# EAGLE design power (EAGLE 9.1.3)
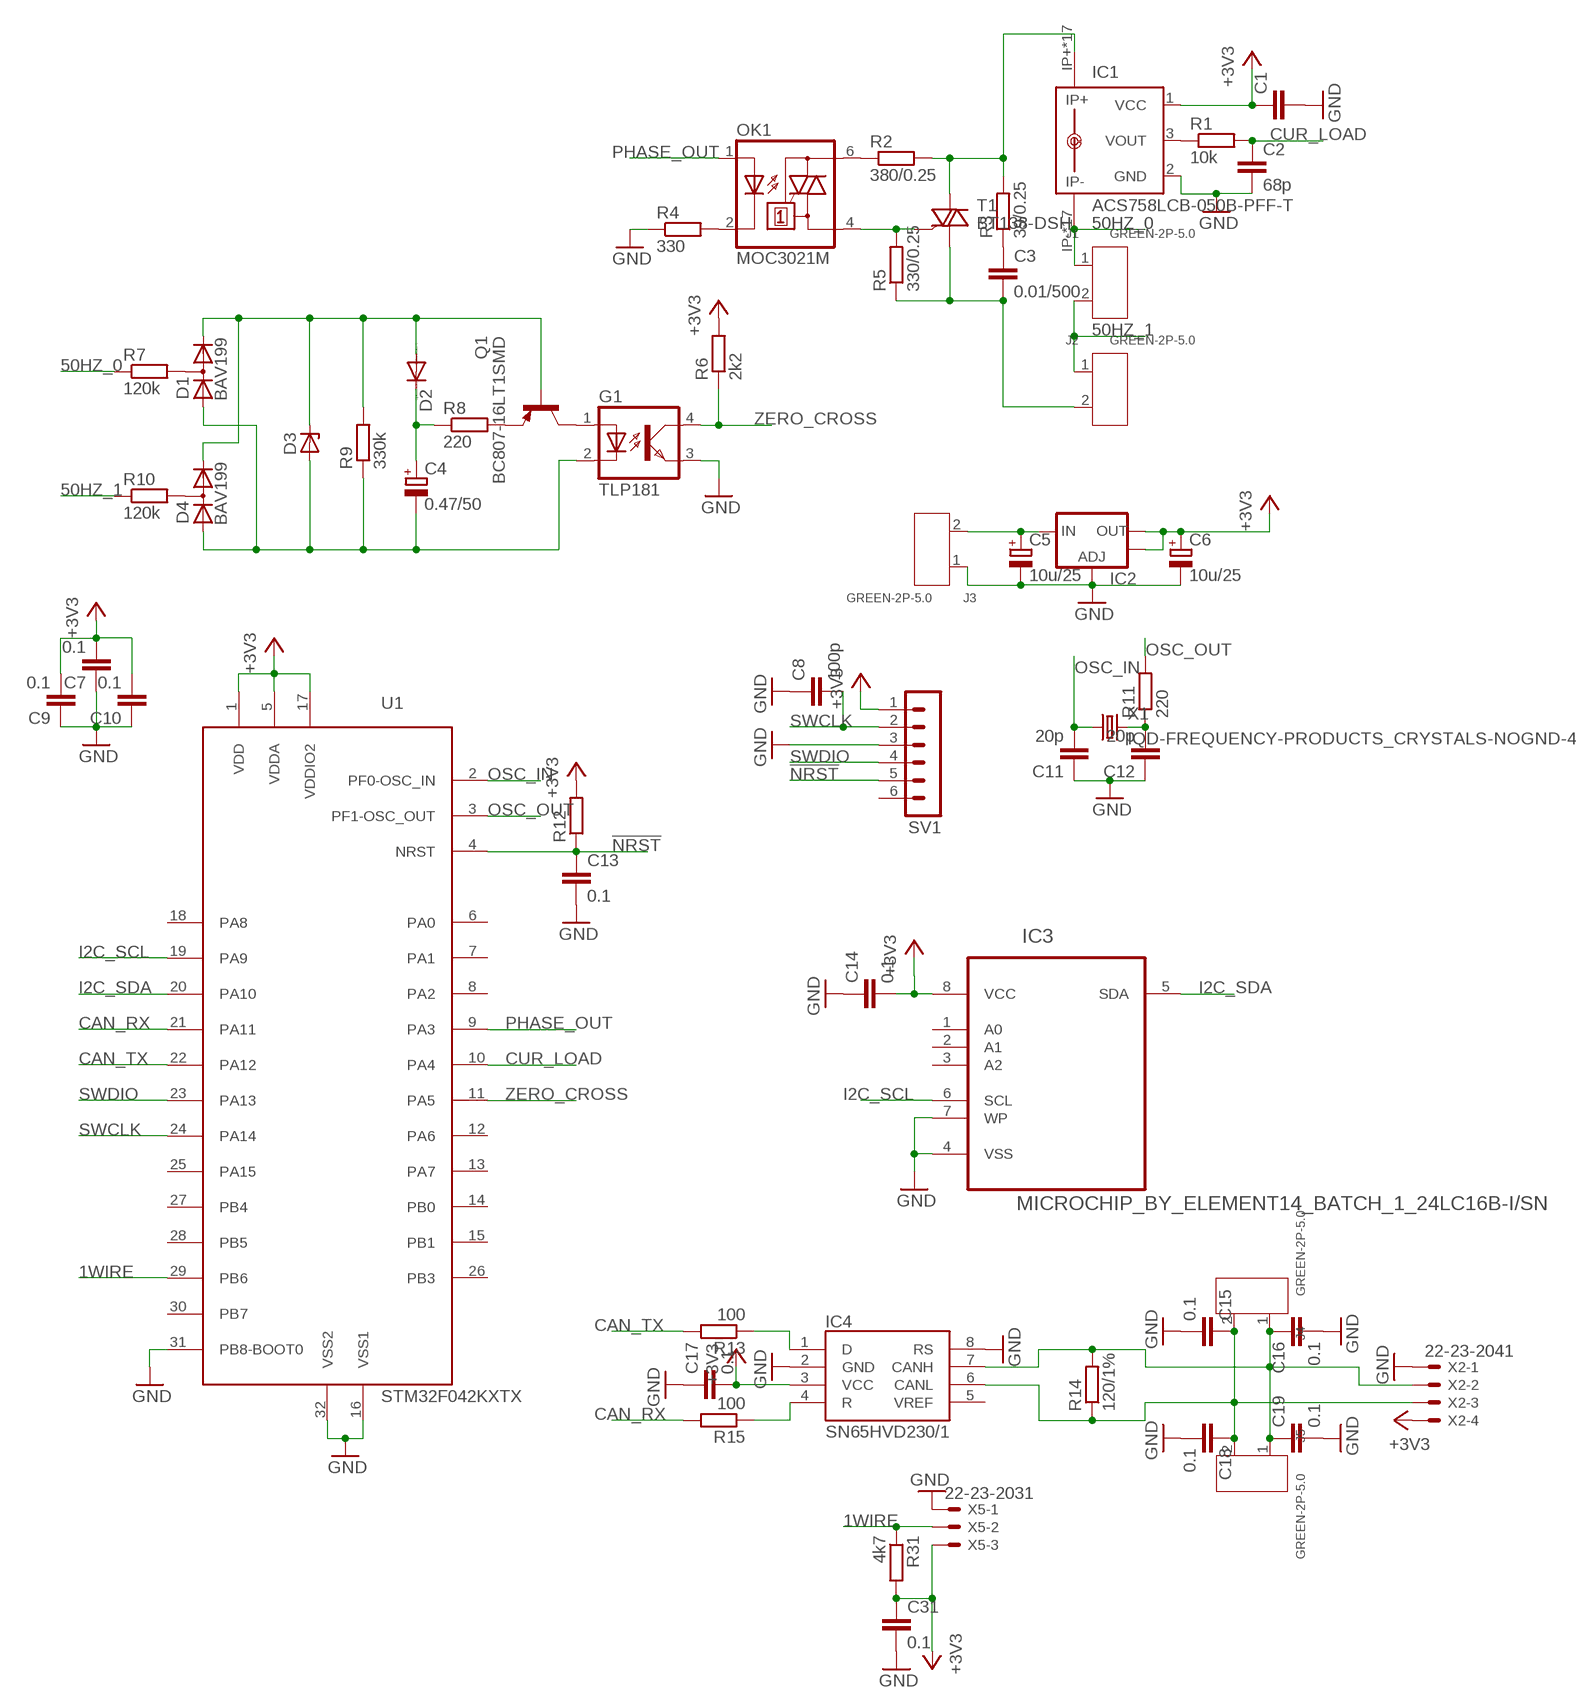
[diagram p0: schematic, sheet 1, part 1 of 2]
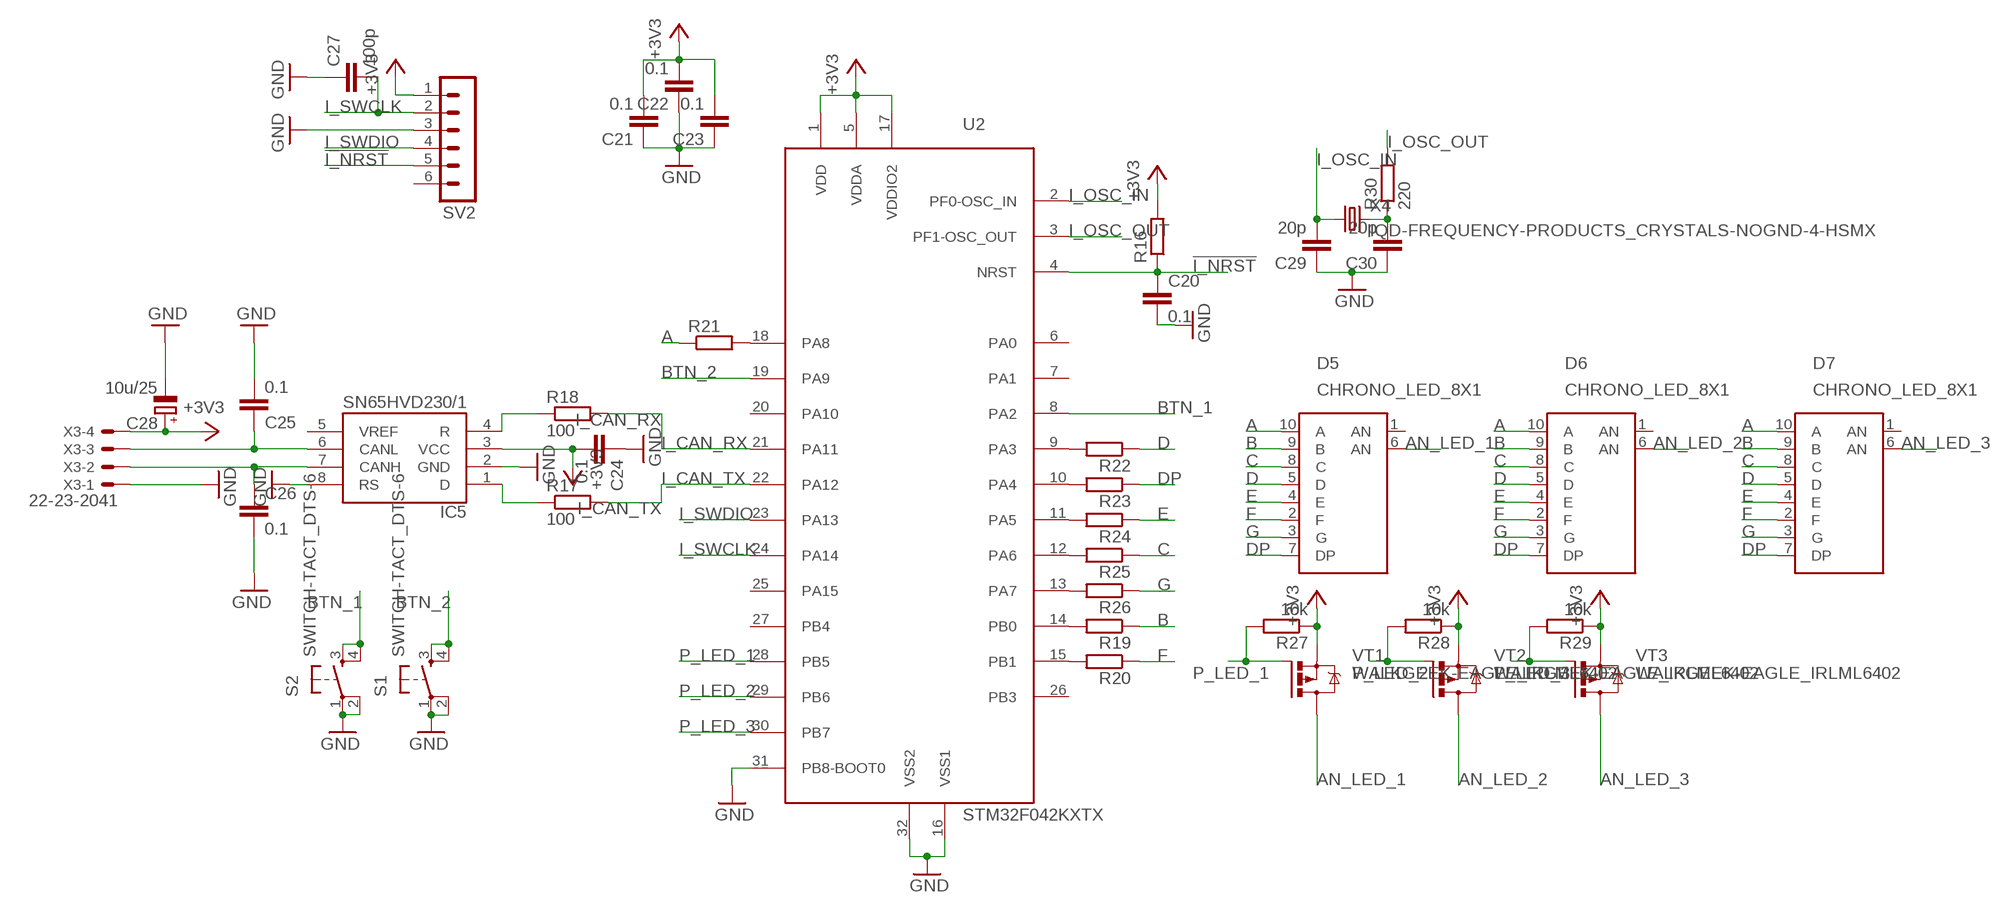
[diagram p1: schematic, sheet 1, part 2 of 2]

## Parts
C1  C-EUC0603  [C0603]
C2  68p  C-EUC0603  [C0603]
C3  0.01/500  C-EUC1206  [C1206]
C4  0.47/50  CPOL-EUC/6032-28R  [C/6032-28R]
C5  10u/25  CPOL-EUSMCB  [SMC_B]
C6  10u/25  CPOL-EUSMCB  [SMC_B]
C7  0.1  C-EUC0603  [C0603]
C8  100p  C-EUC0603  [C0603]
C9  0.1  C-EUC0603  [C0603]
C10  0.1  C-EUC0603  [C0603]
C11  20p  C-EUC0603  [C0603]
C12  20p  C-EUC0603  [C0603]
C13  0.1  C-EUC0603  [C0603]
C14  0.1  C-EUC0603  [C0603]
C15  0.1  C-EUC0603  [C0603]
C16  0.1  C-EUC0603  [C0603]
C17  0.1  C-EUC0603  [C0603]
C18  0.1  C-EUC0603  [C0603]
C19  0.1  C-EUC0603  [C0603]
C20  0.1  C-EUC0603  [C0603]
C21  0.1  C-EUC0603  [C0603]
C22  0.1  C-EUC0603  [C0603]
C23  0.1  C-EUC0603  [C0603]
C24  0.1  C-EUC0603  [C0603]
C25  0.1  C-EUC0603  [C0603]
C26  0.1  C-EUC0603  [C0603]
C27  100p  C-EUC0603  [C0603]
C28  10u/25  CPOL-EUSMCB  [SMC_B]
C29  20p  C-EUC0603  [C0603]
C30  20p  C-EUC0603  [C0603]
C31  0.1  C-EUC0603  [C0603]
D1  BAV199  [SOT23]
D2  DIODE-SOD523  [SOD523]
D3  ZENER-DIODESOD80C  [SOD80C]
D4  BAV199  [SOT23]
D5  CHRONO_LED_8X1  [CHRONO_LED_DIP10]
D6  CHRONO_LED_8X1  [CHRONO_LED_DIP10]
D7  CHRONO_LED_8X1  [CHRONO_LED_DIP10]
G1  TLP181  [SOP04]
IC1  ACS758LCB-050B-PFF-T  [CB-PFF]
IC2  V_REG_LM1117SOT223  [SOT223]
IC3  MICROCHIP_BY_ELEMENT14_BATCH_1_24LC16B-I/SN  [MICROCHIP_BY_ELEMENT14_BATCH_1_SOIC127P600X175-8N]
IC4  SN65HVD230/1  [SO8]
IC5  SN65HVD230/1  [SO8]
J1  GREEN-2P-5.0  SCREW-TERMINAL-GREEN(2P-5.0)  [H2-5.0-10.5X8.0MM]
J2  GREEN-2P-5.0  SCREW-TERMINAL-GREEN(2P-5.0)  [H2-5.0-10.5X8.0MM]
J3  GREEN-2P-5.0  SCREW-TERMINAL-GREEN(2P-5.0)  [H2-5.0-10.5X8.0MM]
J4  GREEN-2P-5.0  SCREW-TERMINAL-GREEN(2P-5.0)  [H2-5.0-10.5X8.0MM]
J5  GREEN-2P-5.0  SCREW-TERMINAL-GREEN(2P-5.0)  [H2-5.0-10.5X8.0MM]
OK1  MOC3021M  [DIL06]
Q1  BC807-16LT1SMD  [SOT23-BEC]
R1  10k  R-EU_R0603  [R0603]
R2  380/0.25  R-EU_M1206  [M1206]
R3  39/0.25  R-EU_M1206  [M1206]
R4  330  R-EU_R0603  [R0603]
R5  330/0.25  R-EU_M1206  [M1206]
R6  2k2  R-EU_R0603  [R0603]
R7  120k  R-EU_R1206  [R1206]
R8  220  R-EU_R1206  [R1206]
R9  330k  R-EU_R1206  [R1206]
R10  120k  R-EU_R1206  [R1206]
R11  220  R-EU_R0603  [R0603]
R12  R-EU_R0603  [R0603]
R13  100  R-EU_R0603  [R0603]
R14  120/1%  R-EU_R0603  [R0603]
R15  100  R-EU_R0603  [R0603]
R16  R-EU_R0603  [R0603]
R17  100  R-EU_R0603  [R0603]
R18  100  R-EU_R0603  [R0603]
R19  R-EU_R0603  [R0603]
R20  R-EU_R0603  [R0603]
R21  R-EU_R0603  [R0603]
R22  R-EU_R0603  [R0603]
R23  R-EU_R0603  [R0603]
R24  R-EU_R0603  [R0603]
R25  R-EU_R0603  [R0603]
R26  R-EU_R0603  [R0603]
R27  10k  R-EU_R0603  [R0603]
R28  10k  R-EU_R0603  [R0603]
R29  10k  R-EU_R0603  [R0603]
R30  220  R-EU_R0603  [R0603]
R31  4k7  R-EU_R0603  [R0603]
S1  SWITCH-TACT_DTS-6  [SWITCH-TACT_DTS-6]
S2  SWITCH-TACT_DTS-6  [SWITCH-TACT_DTS-6]
SV1  CON-LSTB_MA06-1  [CON-LSTB_MA06-1]
SV2  CON-LSTB_MA06-1  [CON-LSTB_MA06-1]
T1  BT138-DSH  [TO220DSH]
U1  STM32F042KXTX  [LQFP32]
U2  STM32F042KXTX  [LQFP32]
VT1  WALKGEEK-EAGLE_IRLML6402  [WALKGEEK-EAGLE_MICRO3]
VT2  WALKGEEK-EAGLE_IRLML6402  [WALKGEEK-EAGLE_MICRO3]
VT3  WALKGEEK-EAGLE_IRLML6402  [WALKGEEK-EAGLE_MICRO3]
X1  IQD-FREQUENCY-PRODUCTS_CRYSTALS-NOGND-4-HSMX  [IQD-FREQUENCY-PRODUCTS_HC49-4-HSMX]
X2  22-23-2041  [22-23-2041]
X3  22-23-2041  [22-23-2041]
X4  IQD-FREQUENCY-PRODUCTS_CRYSTALS-NOGND-4-HSMX  [IQD-FREQUENCY-PRODUCTS_HC49-4-HSMX]
X5  22-23-2031  [22-23-2031]

## Nets
1WIRE: R31.1 U1.29(PB6) X5.2
50HZ_0: IC1.IP- IC1.IP-@2(IP-) IC1.IP-@3(IP-) IC1.IP-@4(IP-) IC1.IP-@5(IP-) IC1.IP-@6(IP-) IC1.IP-@7(IP-) IC1.IP-@8(IP-) IC1.IP-@9(IP-) IC1.IP-@10(IP-) IC1.IP-@11(IP-) IC1.IP-@12(IP-) IC1.IP-@13(IP-) IC1.IP-@14(IP-) IC1.IP-@15(IP-) IC1.IP-@16(IP-) IC1.IP-@17(IP-) J1.1 R7.1
50HZ_1: J1.2 J2.1 R10.1
!I_NRST: C20.1 R16.1 SV2.5 U2.4(NRST)
!NRST: C13.1 R12.1 SV1.5 U1.4(NRST)
+3V3: C1.1 C6.+ C7.2 C9.2 C10.2 C14.2 C17.2 C31.1 IC1.1(VCC) IC2.2(OUT) IC2.4(OUT) IC3.8(VCC) IC4.3(VCC) R6.2 R12.2 R31.2 SV1.1 U1.1(VDD) U1.5(VDDA) U1.17(VDDIO2) X2.4 X5.3
A: D5.10(A) D6.10(A) D7.10(A) R21.1
AN_LED_1: D5.6(AN) VT1.3(D)
AN_LED_2: D6.6(AN) VT2.3(D)
AN_LED_3: D7.6(AN) VT3.3(D)
B: D5.9(B) D6.9(B) D7.9(B) R19.1
BTN_1: S2.3 S2.4 U2.8(PA2)
BTN_2: S1.3 S1.4 U2.19(PA9)
C: D5.8(C) D6.8(C) D7.8(C) R25.1
CAN_RX: R15.2 U1.21(PA11)
CAN_TX: R13.2 U1.22(PA12)
CUR_LOAD: C2.1 R1.2 U1.10(PA4)
D: D5.5(D) D6.5(D) D7.5(D) R22.1
DP: D5.7(DP) D6.7(DP) D7.7(DP) R23.1
E: D5.4(E) D6.4(E) D7.4(E) R24.1
F: D5.2(F) D6.2(F) D7.2(F) R20.1
G: D5.3(G) D6.3(G) D7.3(G) R26.1
GND: C1.2 C2.2 C5.- C6.- C7.1 C8.1 C9.1 C10.1 C11.1 C12.1 C13.2 C14.1 C15.2 C16.2 C17.1 C18.2 C19.2 C31.2 G1.3(EMIT) IC1.2(GND) IC2.1(ADJ) IC3.4(VSS) IC3.7(WP) IC4.2(GND) IC4.8(RS) J3.1 R4.1 SV1.3 U1.16(VSS1) U1.31(PB8-BOOT0) U1.32(VSS2) X2.1 X5.1
I2C_SCL: IC3.6(SCL) U1.19(PA9)
I2C_SDA: IC3.5(SDA) U1.20(PA10)
I_3V3: C21.2 C22.2 C23.2 C24.2 C28.+ IC5.3(VCC) R16.2 R27.1 R28.1 R29.1 SV2.1 U2.1(VDD) U2.5(VDDA) U2.17(VDDIO2) VT1.2(S) VT2.2(S) VT3.2(S) X3.4 ; supply symbol labelled +3V3
I_CAN_RX: R18.2 U2.21(PA11)
I_CAN_TX: R17.2 U2.22(PA12)
I_GND: C20.2 C21.1 C22.1 C23.1 C24.1 C25.2 C26.2 C27.1 C28.- C29.1 C30.1 IC5.2(GND) IC5.8(RS) S1.1 S1.2 S2.1 S2.2 SV2.3 U2.16(VSS1) U2.31(PB8-BOOT0) U2.32(VSS2) X3.1 ; supply symbol labelled GND
I_OSC_IN: C29.2 U2.2(PF0-OSC_IN) X4.1
I_OSC_OUT: R30.2 U2.3(PF1-OSC_OUT)
I_SWCLK: C27.2 SV2.2 U2.24(PA14)
I_SWDIO: SV2.4 U2.23(PA13)
N$1: D1.3(AC) R7.2
N$2: IC1.3(VOUT) R1.1
N$3: D4.3(AC) R10.2
N$4: D1.2(C) D2.A D3.C D4.2(C) Q1.B R9.2
N$5: C4.- D1.1(A) D3.A D4.1(A) G1.2(C) R9.1
N$6: C4.+ D2.C R8.1
N$7: Q1.E R8.2
N$8: G1.1(A) Q1.C
N$9: OK1.6(A2) R2.1
N$10: C3.1 R3.1
N$11: OK1.4(A1) R5.2 T1.G
N$12: C25.1 IC5.6(CANL) X3.3
N$13: C5.+ IC2.3(IN) J3.2
N$14: OK1.2(C) R4.2
N$15: IC5.1(D) R17.1
N$16: C12.2 R11.1 X1.2
N$17: IC1.IP+ IC1.IP+@2(IP+) IC1.IP+@3(IP+) IC1.IP+@4(IP+) IC1.IP+@5(IP+) IC1.IP+@6(IP+) IC1.IP+@7(IP+) IC1.IP+@8(IP+) IC1.IP+@9(IP+) IC1.IP+@10(IP+) IC1.IP+@11(IP+) IC1.IP+@12(IP+) IC1.IP+@13(IP+) IC1.IP+@14(IP+) IC1.IP+@15(IP+) IC1.IP+@16(IP+) IC1.IP+@17(IP+) R2.2 R3.2 T1.A2
N$18: C3.2 J2.2 R5.1 T1.A1
N$19: IC5.4(R) R18.1
N$20: C15.1 C18.1 IC4.6(CANL) J4.2 J5.2 R14.1 X2.3
N$21: IC4.1(D) R13.1
N$22: IC4.4(R) R15.1
N$23: C26.1 IC5.7(CANH) X3.2
N$24: C16.1 C19.1 IC4.7(CANH) J4.1 J5.1 R14.2 X2.2
N$25: R19.2 U2.14(PB0)
N$26: R20.2 U2.15(PB1)
N$27: R21.2 U2.18(PA8)
N$28: R22.2 U2.9(PA3)
N$29: R23.2 U2.10(PA4)
N$30: R24.2 U2.11(PA5)
N$31: R25.2 U2.12(PA6)
N$32: R26.2 U2.13(PA7)
N$33: C30.2 R30.1 X4.2
OSC_IN: C11.2 U1.2(PF0-OSC_IN) X1.1
OSC_OUT: R11.2 U1.3(PF1-OSC_OUT)
P_LED_1: R27.2 U2.28(PB5) VT1.1(G)
P_LED_2: R28.2 U2.29(PB6) VT2.1(G)
P_LED_3: R29.2 U2.30(PB7) VT3.1(G)
PHASE_OUT: OK1.1(A) U1.9(PA3)
SWCLK: C8.2 SV1.2 U1.24(PA14)
SWDIO: SV1.4 U1.23(PA13)
ZERO_CROSS: G1.4(COL) R6.1 U1.11(PA5)
Unconnected: D5.1(AN) D6.1(AN) D7.1(AN) IC3.1(A0) IC3.2(A1) IC3.3(A2) IC4.5(VREF) IC5.5(VREF) SV1.6 SV2.6 U1.6(PA0) U1.7(PA1) U1.8(PA2) U1.12(PA6) U1.13(PA7) U1.14(PB0) U1.15(PB1) U1.18(PA8) U1.25(PA15) U1.26(PB3) U1.27(PB4) U1.28(PB5) U1.30(PB7) U2.6(PA0) U2.7(PA1) U2.20(PA10) U2.25(PA15) U2.26(PB3) U2.27(PB4)

## Library data of the parts
C1 C3 C7 C8 C10-C20 C22-C27 C29-C31 = rcl:C-EU: CAPACITOR, European symbol
C2 C9 C21 = rcl:C-EU: CAPACITOR, European symbol; SPICEPREFIX: C
C4-C6 C28 = rcl:CPOL-EU: POLARIZED CAPACITOR, European symbol
D1 D4 = diode:BAV199: DIODE low-leakage double diode
D2 = diode:DIODE-: DIODE
D3 = diode:ZENER-DIODE: Z-Diode
D5-D7 = chrono:CHRONO_LED_8X1: edit this description Auto generated by make-symbol-device-package-bsdl.ulp Rev. 44 Source:
G1 = distillery:TLP181
IC1 = allegro:ACS758*: Thermally Enhanced, Fully Integrated, Hall Effect-Based Linear Current Sensor with 100 micro Ohm Current Conductor display layer 49 Reference in BRD and place VIAs on circles Source: http://www.allegromicro.com/en/Products/Part_Numbers/0758/0758.pdf; MPN: ACS758LCB-050B-PFF-T; OC_FARNELL: 1718997; OC_NEWARK: 04R7131
IC2 = SparkFun:V_REG_LM1117: Voltage Regulator LM1117 Standard adjustable voltage regulator but in SMD form. Spark Fun Electronics SKU : COM-00595
IC3 = distillery:MICROCHIP_BY_ELEMENT14_BATCH_1_24LC16B-I/SN: 16K I2C Serial EEPROM; MPN: 24LC16B-I/SN; OC_FARNELL: 1296575; OC_NEWARK: 69K7670; PACKAGE: SOIC-8; SUPPLIER: MICROCHIP
IC4 IC5 = distillery:SN65HVD230/1
J1-J5 = distillery:SCREW-TERMINAL-GREEN(2P-5.0): 320110031
OK1 = optocoupler:MOC30*M: RANDOM-PHASE OPTOISOLATORS TRIAC DRIVER OUTPUT Source: http://www.fairchildsemi.com MOC3020-M.pdf; MF: FAIRCHILD SEMICONDUCTOR; MPN: MOC3021-M; OC_FARNELL: 1021365; OC_NEWARK: 95B7895
Q1 = transistor-pnp:BC807*: PNP Transistror
R1-R3 R5-R12 R14-R16 R18-R30 = rcl:R-EU_: RESISTOR, European symbol
R4 R13 R17 R31 = rcl:R-EU_: RESISTOR, European symbol; SPICEPREFIX: R
S1 S2 = chrono:SWITCH-TACT_DTS-6
SV1 SV2 = distillery:CON-LSTB_MA06-1: PIN HEADER; OC_FARNELL: unknown; OC_NEWARK: unknown
T1 = distillery:BT138: TRIAC Source: http://www.semiconductors.philips.com BT138_SERIES_2.pdf
U1 U2 = stm32f0:STM32F042KXTX
VT1-VT3 = chrono:WALKGEEK-EAGLE_IRLML6402: HEXFET P-Channel Power MOSFET
X1 X4 = distillery:IQD-FREQUENCY-PRODUCTS_CRYSTALS-NOGND: CRYSTALS CAN NOT GROUNDED
X2 X3 = con-molex:22-23-2041: .100" (2.54mm) Center Header - 4 Pin; MF: MOLEX; MPN: 22-23-2041; OC_FARNELL: 1462920; OC_NEWARK: 38C0355
X5 = con-molex:22-23-2031: .100" (2.54mm) Center Header - 3 Pin; MF: MOLEX; MPN: 22-23-2031; OC_FARNELL: 1462950; OC_NEWARK: 30C0862

## Board
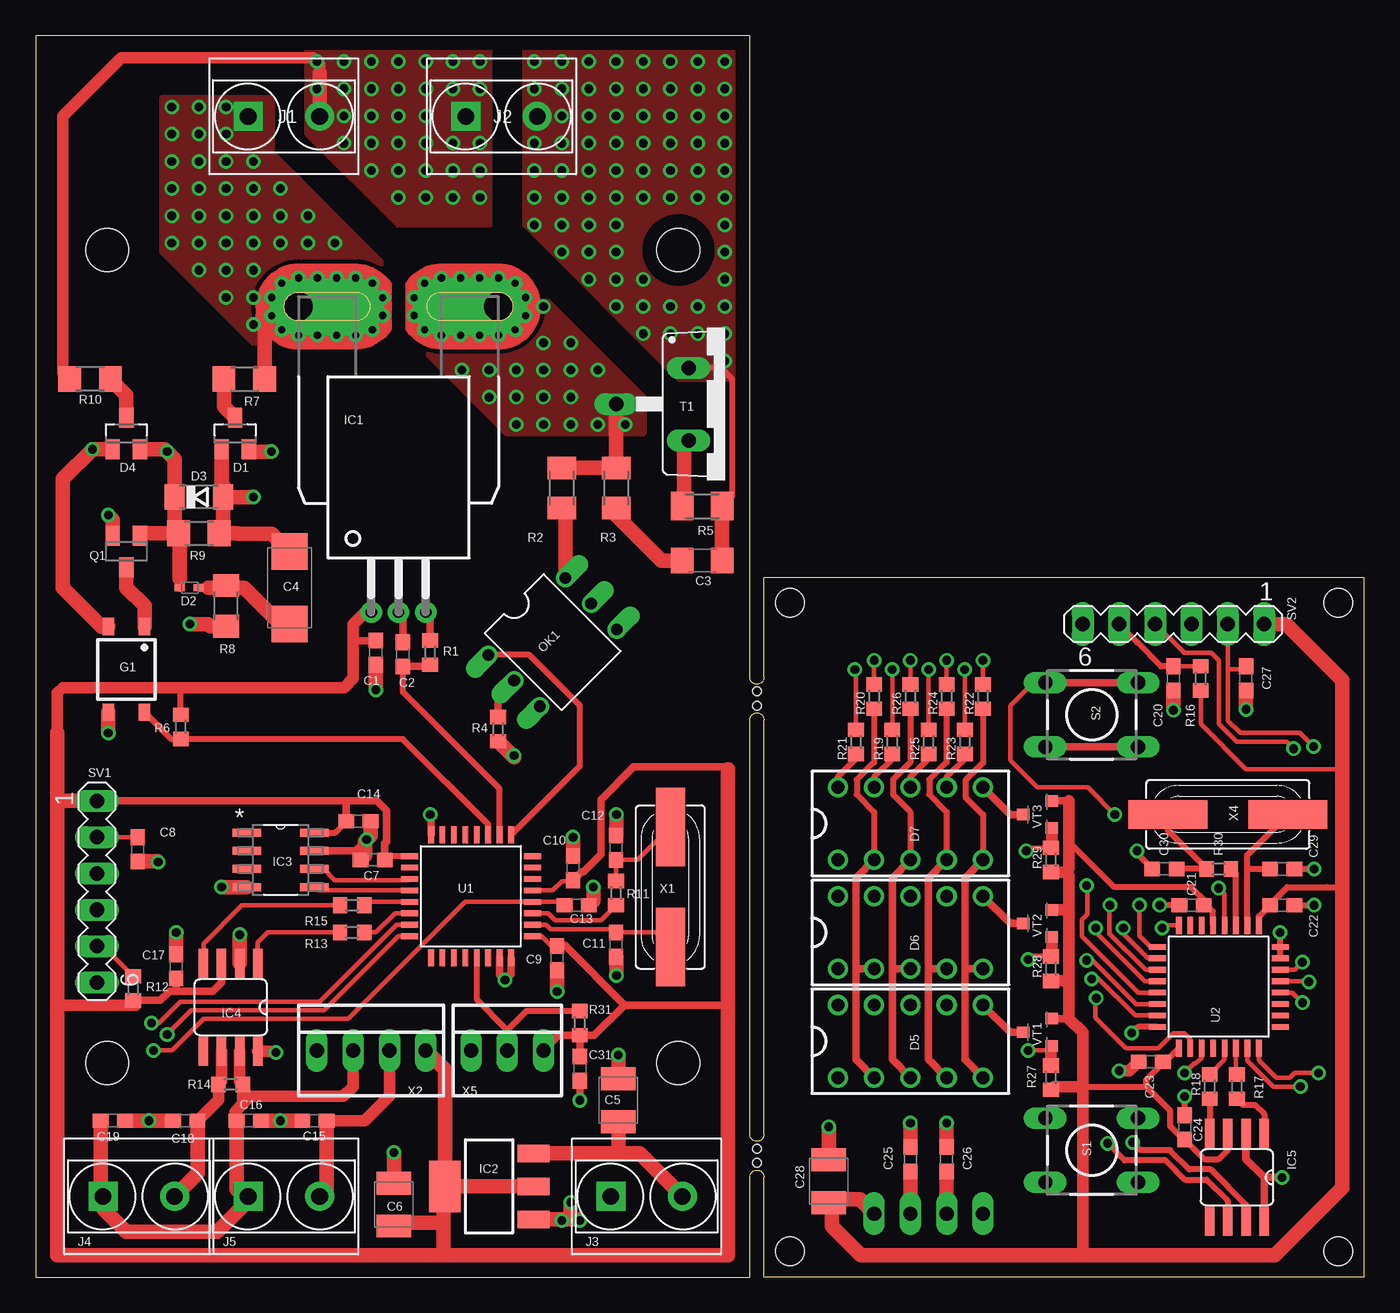
[diagram p2: board, top side]
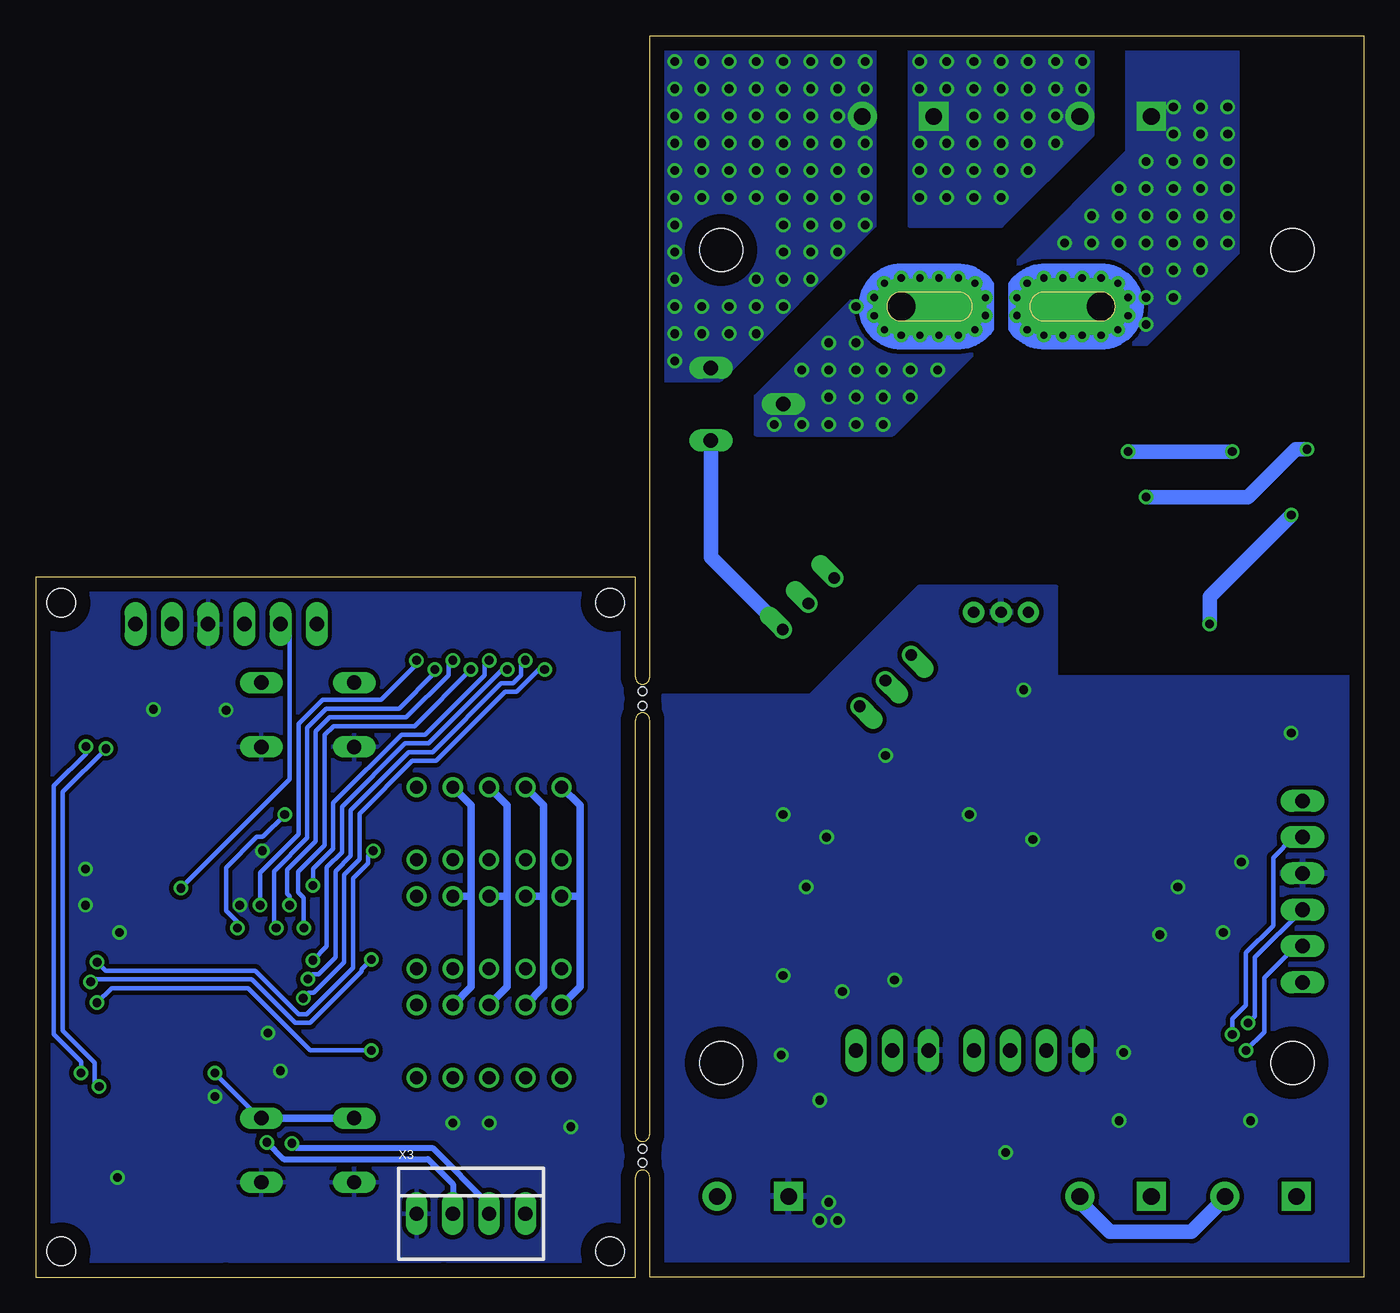
[diagram p3: board, bottom side, seen from below]

Size 93 x 86.9 mm. Coordinates in mm from the lower left corner, seen from the top.
Outline: 0,0 50,0 50,7 arc-180 51,7 51,0 64.42,0 79.67,0 93,0 93,49 51,49 51,42 arc-180 50,42 50,86.9 0,86.9 0,0
Outline: 50,10 50,32.38 50,39 arc-180 51,39 51,10 arc-180 50,10
Copper layers (1*16): Top 0.035mm / dielectric 1.5mm / Bottom 0.035mm
Design rules "default *": minimum track width 10mil, minimum drill 16mil, track to track 12mil, track to pad 12mil, pad to pad 12mil, via to via 12mil, smd to smd 8mil, copper to edge 40mil, drill to drill 0.3mm, minimum pad ring 10mil, minimum via ring 8mil, stop-mask expansion 4mil, vias tented up to drill 0.7mm, thermal gap 10mil
Holes 3 mm at 5,15 45,15 5,71.9 45,71.9
Holes 2 mm at 91.2,1.8 91.2,47.2 52.8,1.8 52.8,47.2
Holes 0.6 mm at 50.5,8 50.5,9 50.5,40 50.5,41

### Footprints (pad centres in the part's own frame; a part is rotated, then mirrored left to right if it is on the bottom)
C0603 = smd 1.1 x 1: 1 -0.85,0; 2 0.85,0
C1206 = smd 1.6 x 1.8: 1 -1.4,0; 2 1.4,0
C/6032-28R = smd 2.55 x 2.5: + 2.525,0; - -2.525,0
SMC_B = smd 1.6 x 2.4: + -1.5,0; - 1.5,0
SOT23 = smd 1 x 1.4: 1 -0.95,-1.1; 2 0.95,-1.1; 3 0,1.1
SOD523 = smd 0.7 x 0.5: A 0.7,0; C -0.6,0
SOD80C = smd 1.4 x 1.8: A 1.7,0; C -1.7,0
CHRONO_LED_DIP10 = drill 0.9 pad 1.4: 1 -2.54,5.08; 2 -2.54,2.54; 3 -2.54,0; 4 -2.54,-2.54; 5 -2.54,-5.08; 6 2.54,-5.08; 7 2.54,-2.54; 8 2.54,0; 9 2.54,2.54; 10 2.54,5.08
SOP04 = smd 0.8 x 1.2: 1 -1.27,-3; 2 1.27,-3; 3 1.27,3; 4 -1.27,3
CB-PFF = drill 0.8 pad 1.5: 1 -1.91,-21.4; 2 0,-21.4; 3 1.91,-21.4 | drill 2 pad 4 offset: IP+ 7,0; IP- -7,0 | drill 0.5 pad 0.9: IP+@2 8.89,0.635; IP+@3 8.89,-0.635; IP+@4 8.175,-1.625; IP+@5 7,-2; IP+@6 5.675,-2; IP+@7 4.35,-2; IP+@8 3,-2; IP+@9 1.825,-1.625; IP+@10 1.1,-0.625; IP+@11 1.1,0.625; IP+@12 1.825,1.625; IP+@13 3,2; IP+@14 4.35,2; IP+@15 5.675,2; IP+@16 7,2; IP+@17 8.175,1.625; IP-@2 -8.89,0.635; IP-@3 -8.89,-0.635; IP-@4 -8.175,-1.625; IP-@5 -7,-2; IP-@6 -5.675,-2; IP-@7 -4.325,-2; IP-@8 -3,-2; IP-@9 -1.825,-1.625; IP-@10 -1.1,-0.625; IP-@11 -1.1,0.625; IP-@12 -1.825,1.625; IP-@13 -3,2; IP-@14 -4.325,2; IP-@15 -5.675,2; IP-@16 -7,2; IP-@17 -8.175,1.625
SOT223 = smd 1.219 x 2.235: 1 -2.311,-3.099; 2 0,-3.099; 3 2.311,-3.099 | smd 3.6 x 2.2: 4 0,3.099
MICROCHIP_BY_ELEMENT14_BATCH_1_SOIC127P600X175-8N = smd 1.981 x 0.559: 1 -2.362,1.905; 2 -2.362,0.635; 3 -2.362,-0.635; 4 -2.362,-1.905; 5 2.362,-1.905; 6 2.362,-0.635; 7 2.362,0.635; 8 2.362,1.905
SO8 = smd 0.66 x 2.032: 1 -1.905,-3.073; 2 -0.635,-3.073; 3 0.635,-3.073; 4 1.905,-3.073; 5 1.905,3.073; 6 0.635,3.073; 7 -0.635,3.073; 8 -1.905,3.073
H2-5.0-10.5X8.0MM = drill 1.168 pad 2.032 square: 1 0,-0.04 | drill 1.168 pad 2.032: 2 0,-5.04
DIL06 = drill 0.813 offset: 1 -2.54,-3.81; 2 0,-3.81; 3 2.54,-3.81; 4 2.54,3.81; 5 0,3.81; 6 -2.54,3.81
SOT23-BEC = smd 1 x 1.4: B -0.95,-1.1; C 0,1.1; E 0.95,-1.1
R0603 = smd 1 x 1.1: 1 -0.85,0; 2 0.85,0
M1206 = smd 1.6 x 2: 1 -1.4,0; 2 1.4,0
R1206 = smd 1.6 x 1.803: 1 -1.422,0; 2 1.422,0
SWITCH-TACT_DTS-6 = drill 1 long: 1 -3.25,2.25; 2 3.25,2.25; 3 -3.25,-2.25; 4 3.25,-2.25
CON-LSTB_MA06-1 = drill 1.016 long: 1 -6.35,0; 2 -3.81,0; 3 -1.27,0; 4 1.27,0; 5 3.81,0; 6 6.35,0
TO220DSH = drill 1.016 long: A1 -2.54,-2.54; A2 0,-7.62; G 2.54,-2.54
LQFP32 = smd 0.4 x 1.2: 1 -2.8,-4.3; 2 -2,-4.3; 3 -1.2,-4.3; 4 -0.4,-4.3; 5 0.4,-4.3; 6 1.2,-4.3; 7 2,-4.3; 8 2.8,-4.3; 17 2.8,4.3; 18 2,4.3; 19 1.2,4.3; 20 0.4,4.3; 21 -0.4,4.3; 22 -1.2,4.3; 23 -2,4.3; 24 -2.8,4.3 | smd 1.2 x 0.4: 9 4.3,-2.8; 10 4.3,-2; 11 4.3,-1.2; 12 4.3,-0.4; 13 4.3,0.4; 14 4.3,1.2; 15 4.3,2; 16 4.3,2.8; 25 -4.3,2.8; 26 -4.3,2; 27 -4.3,1.2; 28 -4.3,0.4; 29 -4.3,-0.4; 30 -4.3,-1.2; 31 -4.3,-2; 32 -4.3,-2.8
WALKGEEK-EAGLE_MICRO3 = smd 0.8 x 0.9: 1 -0.95,-1; 2 0.95,-1; 3 0,1
IQD-FREQUENCY-PRODUCTS_HC49-4-HSMX = smd 5.5 x 2: 1 -4.2,0; 2 4.2,0
22-23-2041 = drill 1 long: 1 -3.81,0; 2 -1.27,0; 3 1.27,0; 4 3.81,0
22-23-2031 = drill 1 long: 1 -2.54,0; 2 0,0; 3 2.54,0

### Placement (x,y rotation side)
C1  23.81,43.71 270 top
C2  25.72,43.6 90 top
C3  46.67,50.16 0 top
C4  17.78,48.26 270 top
C5  40.8,12.38 90 top
C6  25.08,5.08 90 top
C7  23.6,29.21 0 top
C8  7.14,29.95 90 top
C9  36.51,22.33 90 top
C10  37.62,28.63 270 top
C11  40.64,23.28 90 top
C12  40.64,30.06 270 top
C13  37.88,26.04 0 top
C14  22.6,31.91 180 top
C15  19.53,10.95 180 top
C16  14.92,10.95 0 top
C17  9.84,21.75 270 top
C18  10.48,10.95 180 top
C19  5.4,10.95 0 top
C20  79.67,41.91 270 top
C21  80.94,26.04 0 top
C22  87.28,26.04 180 top
C23  78.08,15.08 0 top
C24  80.46,10.48 270 top
C25  61.25,8.26 90 top
C26  63.79,8.26 90 top
C27  84.75,41.91 90 top
C28  55.53,6.71 90 top
C29  87.28,28.57 180 top
C30  79.03,28.57 0 top
C31  38.1,14.61 270 top
D1  13.97,59.05 0 top
D2  10.79,48.26 180 top
D3  11.43,54.61 0 top
D4  6.35,59.05 0 top
D5  61.25,16.51 90 top
D6  61.25,24.13 90 top
D7  61.25,31.75 90 top
G1  6.35,42.55 180 top
IC1  25.4,67.94 0 top
IC2  31.75,6.35 90 top
IC3  17.14,29.21 0 top
IC4  13.65,18.89 180 top
IC5  84.11,6.99 180 top
J1  14.84,81.25 90 top
J2  30.08,81.25 90 top
J3  40.24,5.65 90 top
J4  4.68,5.65 90 top
J5  14.84,5.65 90 top
OK1  36.2,44.45 315 top
Q1  6.35,50.8 180 top
R1  27.62,43.71 270 top
R2  36.83,55.24 90 top
R3  40.64,55.24 90 top
R4  32.38,38.36 90 top
R5  46.67,53.98 180 top
R6  10.16,38.52 90 top
R7  14.61,62.87 180 top
R8  13.34,46.99 270 top
R9  11.43,52.07 180 top
R10  3.81,62.87 0 top
R11  40.64,26.89 270 top
R12  6.83,20.22 270 top
R13  22.17,24.13 0 top
R14  13.65,13.49 0 top
R15  22.17,26.04 0 top
R16  81.57,41.91 270 top
R17  84.11,13.34 90 top
R18  82.2,13.34 90 top
R19  59.98,37.47 90 top
R20  58.71,40.64 90 top
R21  57.44,37.47 90 top
R22  66.33,40.64 90 top
R23  65.06,37.47 90 top
R24  63.79,40.64 90 top
R25  62.52,37.47 90 top
R26  61.25,40.64 90 top
R27  71.09,13.97 90 top
R28  71.09,21.59 90 top
R29  71.09,29.21 90 top
R30  82.84,28.57 0 top
R31  38.1,17.78 270 top
S1  73.95,8.89 180 top
S2  73.95,39.37 180 top
SV1  4.29,26.99 270 top
SV2  79.67,45.72 180 top
T1  48.26,61.12 270 top
U1  30.48,26.67 90 top
U2  82.84,20.32 180 top
VT1  70.14,17.14 90 top
VT2  70.14,24.77 90 top
VT3  70.14,32.38 90 top
X1  44.45,27.3 90 top
X2  23.5,15.88 0 top
X3  62.52,4.45 0 bottom
X4  83.47,32.38 180 top
X5  33.02,15.88 0 top

### Tracks (layer width: path | path; a pad name or v marks a point on that pad's centre or on a via)
1WIRE
  Top 0.406: 33.02,17.3 X5.2 | U1.29 30.88,19.44 33.02,17.3 | R31.1 34.35,18.63 33.02,17.3
50HZ_0  (via drill 0.61)
  Top 1.016: R7.1 16.03,67.16 15.88,67.31 16.51,67.94 IC1.IP-
  other vias: 9.53,78.11 9.53,81.92 11.43,81.92 11.43,80.01 9.53,80.01 11.43,78.11 13.34,78.11 15.24,78.11 9.53,76.2 11.43,76.2 13.34,76.2 15.24,76.2 17.14,76.2 9.53,74.3 11.43,74.3 13.34,74.3 15.24,74.3 17.14,74.3 19.05,74.3 9.53,72.39 11.43,72.39 13.34,72.39 15.24,72.39 17.14,72.39 19.05,72.39 20.95,72.39 11.43,70.48 13.34,70.48 15.24,70.48 13.34,68.58 15.24,68.58 15.24,66.67 13.34,81.92 13.34,80.01
  pour Bottom (no thermals): 24.13,65.41 15.24,65.41 8.89,71.75 8.89,86.36 16.51,86.36 16.51,78.74 24.13,71.12
  pour Top (no thermals): 24.13,71.12 24.13,65.41 15.24,65.41 8.89,71.75 8.89,82.55 16.51,82.55 16.51,78.74
50HZ_1  (via drill 0.61)
  Top 0.813: 19.88,84.26 19.88,84.89 v19.68,85.09 19.41,85.36 5.99,85.36 1.91,81.28 1.91,63.35 R10.1
  Top 1.016: 19.88,84.26 J1.2
  other vias: 21.59,85.09 23.5,85.09 25.4,85.09 27.3,85.09 29.21,85.09 31.11,85.09 31.11,83.19 29.21,83.19 27.3,83.19 25.4,83.19 23.5,83.19 21.59,83.19 23.5,81.28 25.4,81.28 27.3,81.28 21.59,79.38 23.5,79.38 25.4,79.38 27.3,79.38 29.21,79.38 31.11,79.38 23.5,77.47 25.4,77.47 27.3,77.47 29.21,77.47 31.11,77.47 25.4,75.56 27.3,75.56 29.21,75.56 31.11,75.56 19.68,83.19 21.59,81.28
  pour Bottom (no thermals): 19.05,86.36 31.75,86.36 31.75,73.66 25.4,73.66 19.05,80.01
  pour Top (no thermals): 19.05,86.36 31.75,86.36 31.75,73.66 25.4,73.66 19.05,80.01
!I_NRST  (via drill 0.61)
  Top 0.305: v82.84,27.23 83.24,26.83 U2.4 | R16.1 C20.1
  Top 0.406: SV2.5 77.12,44.45 77.12,44.43 78.8,42.76 C20.1
  Bottom 0.305: SV2.5 75.22,45.09 75.22,34.85 v82.84,27.23
!NRST  (via drill 0.61)
  Top 0.305: C13.1 36.8,26.27 U1.4 30.08,26.27 21.88,18.07 11.75,18.07 9.55,15.88 v8.26,15.88 | SV1.5 4.72,23.18 R12.1
  Bottom 0.305: v8.26,15.88 6.99,17.14 6.99,20.95 4.76,23.18 SV1.5
+3V3
  Top 0.305: C9.2 36.45,23.23 36.05,23.23 35.41,23.87 U1.1 | U1.5 36.21,27.07 36.84,27.7 37.55,27.7 C10.2
  Top 0.406: U1.17 24.71,29.47 C7.2 | IC3.8 20.95,31.11 C14.2 | 48.42,35.72 48.42,35.62 48.48,35.56 | R6.2 10.16,41.27
  Top 0.508: IC4.3 13.02,20.64 12.38,20 10.48,20 | 10.48,20 9.37,20 8.73,19.37 R12.2 | C17.2 9.84,20 10.48,20 | C10.2 38.22,28.37 38.35,28.37 39.57,29.59 39.57,33.43 41.86,35.72 48.42,35.72 | 41.23,19.05 37.06,23.22 36.56,23.22 C9.2 | 41.23,19.05 48.48,19.05 | C7.2 24.45,30.38 24.56,30.49 24.56,32.64 23.86,33.34 21.59,33.34 | SV1.1 21.59,33.34 | C14.2 21.75,33.18 21.59,33.34 | C1.1 22.34,44.56 22.23,44.45 | 41.23,19.05 39.11,16.93 R31.2 | R31.2 36.62,16.93 X5.3 | C31.1 R31.2
  Top 0.813: 1.52,38.1 1.52,40.89 1.91,41.27 10.16,41.27 11.43,41.27 21.59,41.27 22.23,41.91 22.23,44.45 22.23,45.72 23.05,46.55 IC1.1 | 1.52,19.05 6.99,19.05 6.83,19.21 R12.2
  Top 1.016: 48.48,35.56 48.48,19.05 48.48,1.91 48.48,1.52 29.84,1.52 28.57,1.52 | 1.52,38.1 1.52,33.66 | 1.52,33.66 1.52,21.27 1.52,19.05 1.52,18.41 1.52,1.52 28.57,1.52 | IC2.2 IC2.4 | IC2.4 28.57,6.27 28.57,3.81 | 28.57,3.81 28.57,1.52 | C6.+ 25.31,3.81 28.57,3.81 | SV1.1 1.84,33.34 1.52,33.66 | X2.4 28.65,14.53 IC2.4
A
  Top 0.406: D7.10 56.17,35.03 57.44,36.3 R21.1
  Bottom 0.508: D5.10 54.9,20.32 54.9,26.67 | 54.9,26.67 54.9,33.02 D7.10 | D6.10 54.9,26.67
AN_LED_1
  Top 0.508: VT1.3 68.23,17.14 D5.6
AN_LED_2
  Top 0.508: VT2.3 68.23,24.77 D6.6
AN_LED_3
  Top 0.508: VT3.3 68.23,32.38 D7.6
B
  Top 0.406: D7.9 58.71,35.03 59.98,36.3 R19.1
  Bottom 0.508: D5.9 57.44,20.32 57.44,26.67 | 57.44,26.67 57.44,33.02 D7.9 | D6.9 57.44,26.67
BTN_1  (via drill 0.61)
  Top 0.305: U2.8 79.04,24.62 v78.87,24.45 | v75.56,32.38 73.66,34.29 70.14,34.29 68.23,36.2 68.23,40.01 69.85,41.62 S2.4
  Top 0.508: S2.4 75.22,41.62 77.12,41.62 S2.3
  Bottom 0.305: v78.87,24.45 78.87,24.83 79.68,25.64 79.68,28.66 77.53,30.81 77.11,30.81 75.54,32.38 v75.56,32.38
BTN_2  (via drill 0.61)
  Top 0.305: v80.46,14.29 81.13,14.96 81.23,14.96 81.64,15.37 U2.19
  Bottom 0.305: v80.46,14.29 77.31,11.14 S1.3
  Bottom 0.508: S1.3 S1.4
C
  Top 0.406: D7.8 61.25,35.03 62.52,36.3 R25.1
  Bottom 0.508: D5.8 60.93,19.37 59.98,20.32 59.98,26.67 | 59.98,26.67 59.98,33.02 D7.8 | D6.8 59.98,26.67
CAN_RX
  Top 0.305: U1.21 23.25,26.27 R15.2
CAN_TX
  Top 0.305: U1.22 25.15,25.47 23.81,24.13 R13.2
CUR_LOAD
  Top 0.406: U1.10 32.48,34.2 25.72,40.96 C2.1
  Top 0.508: C2.1 27.51,42.75 R1.2
D
  Top 0.406: R22.1 66.33,36 65.12,34.79 65.12,33.6 66.33,32.38 D7.5
  Top 0.508: D5.5 65.06,15.24 65.06,21.59 | D7.5 65.06,27.94 65.06,21.59 | D6.5 65.06,21.59
DP
  Top 0.406: D7.7 63.79,35.03 65.06,36.3 R23.1
  Bottom 0.508: D5.7 62.52,20.32 62.52,26.67 | 62.52,26.67 62.52,33.02 D7.7 | D6.7 62.52,26.67
E
  Top 0.406: R24.1 63.79,36.03 62.58,34.82 62.58,33.79 63.79,32.58 D7.4
  Top 0.508: D5.4 62.52,15.24 62.52,21.59 | D7.4 62.52,27.94 62.52,21.59 | D6.4 62.52,21.59
F
  Top 0.406: R20.1 58.71,36.03 57.5,34.82 57.5,33.79 58.71,32.58 D7.2
  Top 0.508: D5.2 57.44,15.24 57.44,21.59 | 57.44,21.59 57.44,27.94 D7.2 | D6.2 57.44,21.59
G
  Top 0.406: R26.1 61.25,36.03 60.04,34.82 60.04,33.79 61.25,32.58 D7.3
  Top 0.508: D5.3 59.98,15.24 59.98,21.59 | D7.3 59.98,27.94 59.98,21.59 | D6.3 59.98,21.59
GND  (via drill 0.61)
  Top 0.508: U1.32 33.28,21.21 v32.86,20.8 32.48,21.18 U1.31 | v27.62,32.38 27.68,32.33 U1.16 | C2.2 25.72,46.23 IC1.2 | C13.2 39.05,26.35 | IC3.7 22.41,29.84 23.09,30.52 | C31.2 v38.1,12.38
  Top 0.813: v33.5,36.51 33.5,36.4 | v23.18,30.64 23.09,30.55 23.09,30.52 | IC4.8 16.73,15.82 v16.83,15.72
  Top 1.016: C16.2 v17.14,10.95 C15.2 | C12.1 40.67,30.94 v40.67,32.38 | v5.08,38.1 G1.3 | C11.1 40.67,22.4 v40.67,21.11 | C19.2 v7.94,10.95 C18.2 | C9.1 v36.51,20 | v37.62,30.8 C10.1 | 39.05,26.35 v39.05,27.3 | IC3.4 v13.02,27.3 | C7.1 23.09,29.55 23.09,30.52 23.45,30.89 C14.1 | IC4.2 v14.29,23.97 | C17.1 v9.84,24.13 | 33.5,36.4 R4.1 | IC2.1 37.47,4.04 | 37.47,4.04 38.03,4.04 v38.1,3.97 | C6.- v25.08,8.73 | C1.2 v23.81,41.12 | v37.47,5.24 37.47,4.04 | C8.1 8.53,29.1 v8.57,29.05 | C5.- v40.8,15.56
  other vias: 36.83,3.97
  pour Bottom: 0.64,41.91 21.59,41.91 21.59,48.26 31.11,48.26 38.73,40.64 49.53,40.64 49.53,0.64 0.64,0.64
I2C_SCL
  Top 0.305: U1.19 26.11,27.8 20.94,27.8 20.16,28.57 IC3.6
I2C_SDA
  Top 0.305: U1.20 19.74,27.07 IC3.5
I_3V3
  Top 0.305: 79.1,15.08 79.03,15.08 C23.2 | 91.48,35.56 84.75,35.56 81.57,38.73 R16.2
  Top 0.406: U2.5 82.44,25.58 82.1,25.93 | 82.1,25.93 81.99,26.04 C21.2 | U2.1 85.64,25.24 C22.2 86.44,26.1 87.64,27.3 90.46,27.3 91.48,27.3 | U2.17 79.1,15.08 | 82.1,25.93 82.1,26.14 80.94,27.3 75.54,27.3 72.36,30.48 | C24.2 80.75,9.34 | 80.75,9.34 81.83,8.26 82.84,8.26 83.47,8.89 IC5.3 | 73.31,13.34 77.76,13.34 | 77.76,13.34 79.45,11.64 79.45,10.57 80.68,9.34 80.75,9.34 | 77.76,13.34 77.76,13.81 79.03,15.08
  Top 0.508: VT1.2 72.36,18.09 | VT3.2 72.36,33.34
  Top 0.813: 72.36,20.95 72.36,18.09 73.31,17.14 73.31,13.34 | 72.36,33.34 72.36,32.38 72.36,30.48 72.36,28.57 72.15,28.36 | 73.31,13.34 73.31,1.52 | R27.1 71.31,13.34 73.31,13.34 | R28.1 72.15,20.74 72.36,20.95 | 72.15,28.36 R29.1 | 72.36,20.95 72.36,25.72 | 72.36,25.72 72.36,28.14 72.15,28.36 | VT2.2 72.36,25.71 72.36,25.72
  Top 1.016: 55.77,5.45 57.71,5.45 X3.4 | 55.77,5.45 C28.+ | 55.77,5.45 55.77,3.55 57.79,1.52 58.71,1.52 59.34,1.52 72.36,1.52 72.68,1.52 73.31,1.52 86.76,1.52 91.48,6.24 91.48,27.3 91.48,35.56 91.48,38.1 91.48,38.73 91.48,40.01 91.48,41.8 87.56,45.72 SV2.1
I_CAN_RX
  Top 0.305: U2.21 83.24,15.22 R18.2
I_CAN_TX
  Top 0.305: U2.22 84.04,14.26 R17.2
I_GND  (via drill 0.61)
  Top 0.406: v76.75,17.09 76.75,17.09 77.18,17.52 U2.16 | C21.1 v78.71,26.04 | C22.1 v89.51,26.04 | C29.1 v89.51,28.57 | v77.12,29.84 77.12,29.63 C30.1 | C24.1 v80.46,12.65 | v87.13,24.13 87.13,23.13 U2.32 U2.31
  Top 0.508: IC5.2 84.75,8.26 86.02,6.99 | IC5.8 86.02,6.99 | v87.28,6.99 86.02,6.99 | S2.1 S2.2
  Top 0.813: v75.86,14.45 76.59,14.45 C23.1
  Top 1.016: C28.- v55.53,10.53 | C25.2 v61.25,10.79 | C26.2 v63.79,10.79 | C20.2 v79.67,39.69 | C27.1 v84.75,39.75
  pour Bottom: 51,0 51,49 93,49 93,0
I_OSC_IN
  Top 0.406: U2.2 84.84,28.57 | 84.84,28.57 84.84,29.55 X4.1 | 84.84,28.57 C29.2
I_OSC_OUT
  Top 0.406: R30.2 84.04,28.23 U2.3
I_SWCLK  (via drill 0.61)
  Top 0.305: U2.24 85.64,15.21 85.73,15.13 85.73,15.12 86.88,13.97 87.83,13.97 88.16,14.3 89.81,14.3 v89.83,14.29 | SV2.2 83.47,42.55 | 83.47,42.55 83.47,38.96 84.34,38.1 88.52,38.1 v89.47,37.15 | C27.2 84.53,42.55 83.47,42.55
  Bottom 0.305: v89.83,14.29 89.83,15.08 91.73,16.99 91.73,34.38 89.47,36.65 v89.47,37.15
I_SWDIO  (via drill 0.61)
  Top 0.305: U2.23 84.84,15.14 84.85,15.14 85.12,14.87 86.65,13.34 v88.56,13.34 | SV2.4 80.35,43.77 80.4,43.72 82.31,43.72 82.84,43.19 82.84,38.73 84.11,37.47 87.6,37.47 v88.08,36.99
  Bottom 0.305: v88.56,13.34 88.86,13.64 88.86,15.01 91.09,17.24 91.09,33.97 v88.08,36.99
N$1
  Top 1.016: D1.3 13.18,60.94 R7.2
N$2
  Top 0.508: R1.1 27.62,46.23 IC1.3
N$3
  Top 1.016: D4.3 6.35,61.75 R10.2
N$4  (via drill 0.6)
  Top 0.61: 10.1,48.9 D2.A
  Top 1.016: v16.51,57.78 15.09,57.78 D1.2 | R9.2 9.73,52.35 D3.C 9.73,57.26 v9.21,57.78 9.04,57.95 D4.2 | R9.2 7.47,52.07 Q1.B | R9.2 10.1,51.98 10.1,48.9
  Bottom 1.016: v9.21,57.78 v16.51,57.78
N$5  (via drill 0.6)
  Top 1.016: D3.A 13.13,55.45 13.02,55.56 D1.1 | D3.A 13.13,52.35 R9.1 14.12,52.07 14.14,52.05 16.51,52.05 C4.- | v15.24,54.61 D3.A | D4.1 v3.98,57.95 1.91,55.88 1.91,48.26 4.62,45.55 G1.2
  Bottom 1.016: v15.24,54.61 8.11,54.61 4.76,57.95 v3.98,57.95
N$6
  Top 0.61: 12.06,48.26 D2.C
  Top 1.016: 12.06,48.26 13.18,48.26 R8.1 13.49,48.26 14.61,48.26 17.13,45.73 C4.+
N$7  (via drill 0.6)
  Top 1.016: R8.2 12.22,45.57 12.06,45.72 v10.79,45.72 | Q1.E 5.4,53.02 v5.08,53.34
  Bottom 1.016: v10.79,45.72 10.79,47.62 v5.08,53.34
N$8
  Top 1.016: G1.1 7.62,46.99 6.35,48.26 Q1.C
N$9
  Top 1.016: OK1.6 37.09,53.58 R2.1
N$10
  Top 1.016: C3.1 43.81,50.16 40.64,53.34 R3.1
N$11
  Top 1.016: R5.2 45.4,54.1 45.4,58.26 T1.G
  Bottom 1.016: OK1.4 45.72,50.38 T1.G
N$12  (via drill 0.61)
  Top 0.406: IC5.6 83.47,5.34 81.99,6.83 80.48,6.83 79.13,8.18 76.25,8.18 v75.06,9.37
  Top 1.016: X3.3 C25.1
  Bottom 0.406: v75.06,9.37 74.74,9.05 65.22,9.05 61.25,5.08 X3.3
N$13
  Top 1.016: IC2.3 40.01,8.66 40.8,8.66 | J3.2 42.27,8.66 41.12,8.66 40.8,8.66 | C5.+ 40.8,8.66
N$14
  Top 0.508: R4.2 32.38,40.64 OK1.2
N$15
  Top 0.406: R17.1 84.53,12.06 85.38,12.06 86.02,11.43 IC5.1
N$16
  Top 0.305: R11.1 C12.2 42.16,29.21 X1.2
N$17  (via drill 0.61)
  Top 1.016: R2.2 R3.2 T1.A2
  other vias: 35.56,67.94 35.56,65.41 37.47,65.41 29.84,63.5 31.75,63.5 33.66,63.5 35.56,63.5 37.47,63.5 39.37,63.5 31.75,61.59 33.66,61.59 35.56,61.59 37.47,61.59 33.66,59.69 35.56,59.69 37.47,59.69 39.37,59.69 41.27,59.69
  pour Bottom (no thermals): 42.55,61.59 42.55,59.05 33.02,59.05 26.67,65.41 26.67,70.48 33.66,70.48
  pour Top (no thermals): 33.66,70.48 42.55,61.59 42.55,59.05 33.02,59.05 26.67,65.41 26.67,70.48
N$18  (via drill 0.61)
  Top 0.406: R5.1 48.78,54.68 48.78,62.87 47.99,63.66 T1.A1
  Top 1.016: R5.1 C3.2
  other vias: 34.92,85.09 36.83,85.09 38.73,85.09 40.64,85.09 42.55,85.09 44.45,85.09 46.35,85.09 48.26,85.09 34.92,83.19 36.83,83.19 38.73,83.19 40.64,83.19 42.55,83.19 44.45,83.19 46.35,83.19 48.26,83.19 38.73,81.28 40.64,81.28 42.55,81.28 44.45,81.28 46.35,81.28 48.26,81.28 34.92,79.38 36.83,79.38 38.73,79.38 40.64,79.38 42.55,79.38 44.45,79.38 46.35,79.38 48.26,79.38 34.92,77.47 36.83,77.47 38.73,77.47 40.64,77.47 42.55,77.47 44.45,77.47 46.35,77.47 48.26,77.47 34.92,75.56 36.83,75.56 38.73,75.56 40.64,75.56 42.55,75.56 44.45,75.56 46.35,75.56 48.26,75.56 48.26,73.66 40.64,73.66 38.73,73.66 36.83,73.66 34.92,73.66 36.83,71.75 38.73,71.75 40.64,71.75 38.73,69.85 40.64,69.85 42.55,69.85 48.26,69.85 48.26,71.75 40.64,67.94 42.55,67.94 44.45,67.94 46.35,67.94 48.26,67.94 42.55,66.04 44.45,66.04 46.35,66.04 48.26,66.04 36.83,81.28 48.26,64.14
  pour Bottom (no thermals): 34.29,86.36 49.53,86.36 49.53,62.87 45.09,62.87 34.29,73.66
  pour Top (no thermals): 34.29,86.36 49.53,86.36 49.53,62.87 45.09,62.87 34.29,73.66
N$19
  Top 0.406: R18.1 IC5.4
N$20
  Top 0.813: C18.1 12.8,12.43 R14.1 13.02,13.71 IC4.6 | C15.1 23.02,10.95 24.77,12.7 X2.3
  Top 1.016: C18.1 11.33,7.26 J4.2 | J5.2 20.38,6.15 C15.1
  Bottom 1.016: J4.2 9.72,5.52 12.06,3.17 17.78,3.17 19.88,5.28 J5.2
N$21
  Top 0.305: R13.1 16.24,24.13 15.56,23.45 IC4.1
N$22
  Top 0.305: R15.1 14.44,26.04 11.75,23.34 IC4.4
N$23  (via drill 0.61)
  Top 0.406: IC5.7 84.75,5.08 82.28,7.54 80.77,7.54 79.43,8.89 77.36,8.89 v76.81,9.44
  Top 1.016: X3.2 C26.1
  Bottom 0.406: v76.81,9.44 75.62,8.26 65.54,8.26 63.79,6.51 X3.2
N$24
  Top 0.813: 14.5,12.12 R14.2 14.29,13.71 IC4.7 | 14.5,12.12 13.97,11.59 13.97,11.06 C16.1 | X2.2 22.23,13.34 21.54,12.65 15.03,12.65 14.5,12.12
  Top 1.016: 14.88,5.36 12.7,3.17 6.35,3.17 4.72,4.8 J4.1 4.55,5.82 C19.1 | 14.88,5.36 J5.1 | C16.1 14.07,6.16 14.88,5.36
N$25  (via drill 0.61)
  Top 0.305: U2.14 77.06,19.12 73.99,22.18 v73.58,22.18 | R19.2 v59.98,42.55
  Bottom 0.305: v73.58,22.18 72.62,23.15 72.62,28.68 71.55,29.74 71.55,32.94 67.13,37.36 65.48,37.36 60.29,42.55 v59.98,42.55
N$26  (via drill 0.61)
  Top 0.305: U2.15 76.99,18.32 74.36,20.95 73.95,20.95 v73.95,20.86 | R20.2 v58.71,43.18
  Bottom 0.305: v73.95,20.86 73.59,21.22 73.18,21.22 72.01,22.39 72.01,28.43 70.94,29.49 70.94,32.69 66.88,36.75 65.22,36.75 60.4,41.58 59.58,41.58 59.02,42.15 59.02,42.55 59.02,42.96 58.8,43.18 v58.71,43.18
N$27  (via drill 0.61)
  Top 0.305: R21.2 57.44,42.55 v57.36,42.55 | U2.18 80.86,16.04 80.86,16.65 80.43,17.08 79.65,17.08 78.61,16.04 76.33,16.04 74.19,18.17 74.19,19.45 v74.27,19.53
  Bottom 0.305: v74.27,19.53 73.9,19.89 73.55,19.89 73.54,19.91 71.4,22.05 71.4,28.17 70.33,29.24 70.33,32.43 66.62,36.14 64.97,36.14 60.14,40.97 59.33,40.97 57.74,42.55 v57.36,42.55
N$28  (via drill 0.61)
  Top 0.305: v77.28,26.04 77.28,23.9 78.06,23.12 U2.9 | R22.2 v66.33,43.18
  Bottom 0.305: v77.28,26.04 77.28,28.32 74.6,31 74.6,38.72 72.91,40.41 68.81,40.41 66.33,42.89 v66.33,43.18
N$29  (via drill 0.61)
  Top 0.305: U2.10 77.89,22.32 76.16,24.05 v76.16,24.45 | R23.2 v65.06,42.55
  Bottom 0.305: v65.06,42.55 65.06,42.29 67.55,39.8 72.66,39.8 73.99,38.47 73.99,30.75 76.32,28.42 76.32,24.61 v76.16,24.45
N$30  (via drill 0.61)
  Top 0.305: U2.11 78.52,21.5 77.74,21.5 75.19,24.05 75.19,26.03 v75.22,26.04 | R24.2 v63.79,43.18
  Bottom 0.305: v63.79,43.18 64.1,43.18 64.1,42.95 64.09,42.95 64.09,42.15 67.05,39.19 72.41,39.19 73.38,38.22 73.38,30.5 75.38,28.5 75.38,26.83 75.22,26.67 v75.22,26.04
N$31  (via drill 0.61)
  Top 0.305: v74.23,24.45 74.08,24.3 77.68,20.7 78.52,20.7 U2.12 | R25.2 v62.52,42.55
  Bottom 0.305: v74.23,24.45 74.23,26.54 74.63,26.94 74.63,28.39 72.77,30.25 72.77,37.96 72.15,38.58 66.48,38.58 v62.52,42.55
N$32  (via drill 0.61)
  Top 0.305: U2.13 77.21,19.92 73.26,23.86 73.26,25.03 73.63,25.4 73.63,27.36 v73.58,27.41 | R26.2 v61.25,43.18
  Bottom 0.305: v73.58,27.41 73.58,28.57 72.16,30 72.16,33.19 67.38,37.97 65.73,37.97 61.55,42.15 61.55,42.88 v61.25,43.18
N$33
  Top 0.406: X4.2 79.28,31.29 R30.1 C30.2
OSC_IN
  Top 0.305: X1.1 43.42,24.13 C11.2 40.42,24.35 36.05,24.35 35.73,24.67 U1.2
OSC_OUT
  Top 0.305: R11.2 39.6,24.99 36.37,24.99 35.89,25.47 U1.3
P_LED_1  (via drill 0.61)
  Top 0.305: U2.28 88,19.92 v88.71,19.21 | v69.5,15.88 70.82,15.88 71.09,16.15
  Top 0.813: VT1.1 71.09,16.15 R27.2
  Bottom 0.305: v88.71,19.21 87.69,20.23 78.12,20.23 75.77,17.87 73.77,15.88 v69.5,15.88
P_LED_2  (via drill 0.61)
  Top 0.305: U2.29 89.19,20.72 89.19,20.71 v89.15,20.68 | v69.5,22.23 69.77,22.49 71.14,22.49
  Top 0.813: VT2.1 71.14,22.49 R28.2
  Bottom 0.305: v69.5,22.23 70.17,21.57 70.17,21.4 73.77,17.79 74.83,17.79 77.87,20.84 88.99,20.84 v89.15,20.68
P_LED_3  (via drill 0.61)
  Top 0.305: U2.30 88.17,21.52 v88.69,22.05 | R29.2 69.72,30.06 69.5,29.84 v69.37,29.84
  Top 0.813: VT3.1 71.14,30.11 R29.2
  Bottom 0.305: v69.37,29.84 69.72,29.49 69.72,28.98 70.78,27.93 70.78,21.65 74.03,18.4 74.57,18.4 77.62,21.45 88.1,21.45 v88.69,22.05
PHASE_OUT
  Top 0.406: U1.9 38.1,35.79 38.1,40.01 34.55,43.55 OK1.1
SWCLK  (via drill 0.61)
  Top 0.305: C8.2 6.99,30.8 SV1.2 | U1.24 25.39,23.87 20.2,18.68 10.9,18.68 v9.21,16.99
  Bottom 0.305: SV1.2 4.92,30.8 6.35,29.37 6.35,24.61 8.26,22.7 8.26,19.05 9.21,18.1 v9.21,16.99
SWDIO  (via drill 0.61)
  Top 0.305: U1.23 25.27,24.67 23.48,22.88 19.89,19.29 10.12,19.29 9.62,18.79 8.61,17.78 v8.1,17.78
  Bottom 0.305: SV1.4 7.62,22.38 7.62,18.26 v8.1,17.78
ZERO_CROSS
  Top 0.406: U1.11 31.68,31.69 25.7,37.67 R6.1 9.49,37.67 G1.4